# Altium project 啊度no.PrjPcb
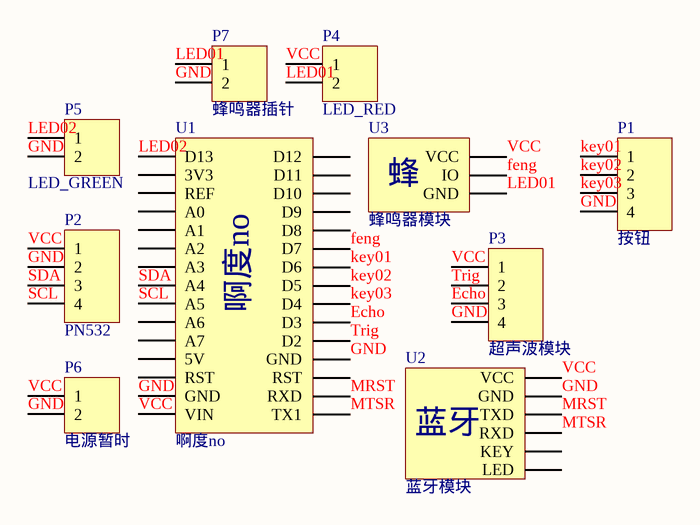
[diagram p0: 啊度no.SchDoc]
1 sheet, 10 parts. Net scope: global (net labels, ports and power ports of the same name join across sheets).
Board file: 啊度no.PcbDoc

## Sheet 啊度no.SchDoc
size A4

### Parts
P1  按钮  [HDR1X4]
P2  PN532  [HDR1X4]
P3  超声波模块  [HDR1X4]
P4  LED_RED  [HDR1X2]
P5  LED_GREEN  [HDR1X2]
P6  电源暂时  [HDR1X2]
P7  蜂鸣器插针  [HDR1X2]
U1  啊度no  [啊度no]
U2  蓝牙模块  [蓝牙模块]
U3  蜂鸣器模块  [蜂鸣器模块]

### Nets
Echo: P3.3 U1.D3
feng: U1.D7 U3.IO
GND: P1.4 P2.2 P3.4 P5.2 P6.2 P7.2 U1.GND U2.GND
key01: P1.1 U1.D6
key02: P1.2 U1.D5
key03: P1.3 U1.D4
LED01: P4.2 P7.1 U3.GND
LED02: P5.1 U1.D13
MRST: U1.RXD U2.TXD
MTSR: U1.TX1 U2.RXD
SCL: P2.4 U1.A5
SDA: P2.3 U1.A4
Trig: P3.2 U1.D2
VCC: P2.1 P3.1 P4.1 P6.1 U1.VIN U2.VCC U3.VCC

Not connected (* = marked no-connect by the designer): U1 3V3 5V A0 A1 A2 A3 A6 A7 D8 D9 D10 D11 D12 REF RST; U2 KEY LED

### Notes on the sheet
- (in symbol 蓝牙模块) 蓝牙
- (in symbol 蜂鸣器模块) 蜂

### Library data of the parts
P1-P3 = Header 4: Header, 4-Pin; LatestRevisionDate: 17-Jul-2002; LatestRevisionNote: Re-released for DXP Platform.; Publisher: Altium Limited
P4-P7 = Header 2: Header, 2-Pin; LatestRevisionDate: 17-Jul-2002; LatestRevisionNote: Re-released for DXP Platform.; Publisher: Altium Limited